# Altium project PCB_Project.PrjPcb
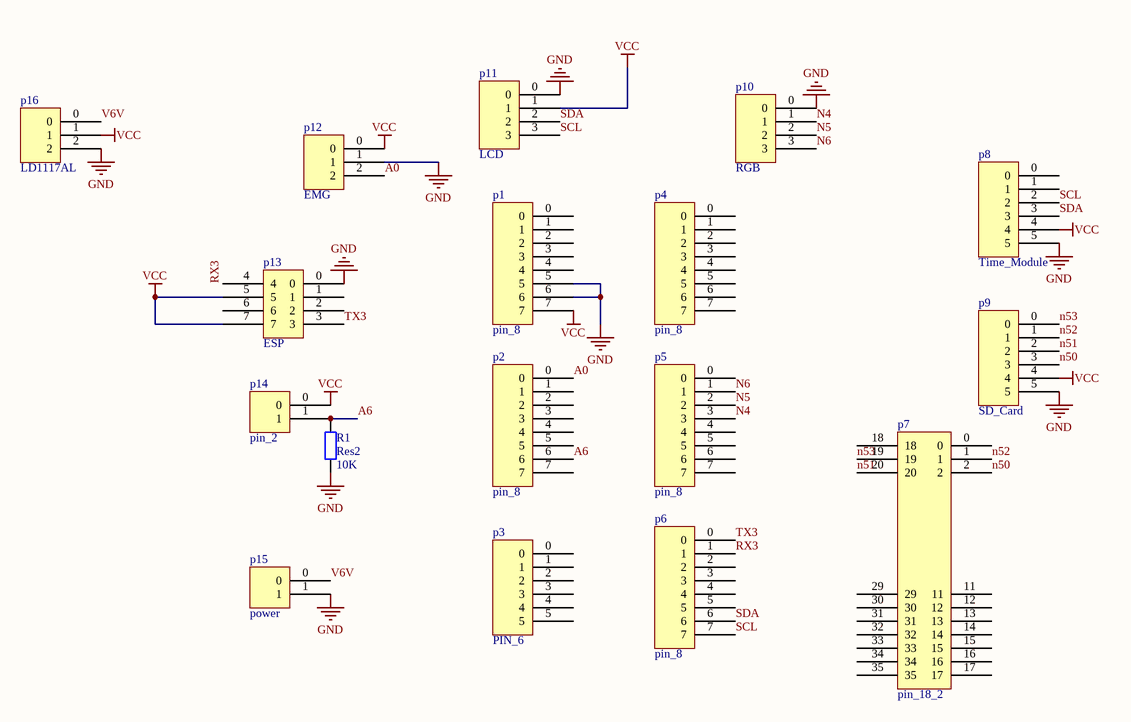
[diagram p0: Sheet1.SchDoc]
1 sheet, 17 parts. Net scope: global (net labels, ports and power ports of the same name join across sheets).
Board file: PCB1.PcbDoc

## Sheet Sheet1.SchDoc
size A4

### Parts
p1  pin_8  [pin_8]
p2  pin_8  [pin_8]
p3  PIN_6  [pin_6]
p4  pin_8  [pin_8]
p5  pin_8  [pin_8]
p6  pin_8  [pin_8]
p7  pin_18_2  [pin_18_2]
p8  Time_Module  [pin_6]
p9  SD_Card  [pin_6]
p10  RGB  [pin_4]
p11  LCD  [pin_4]
p12  EMG  [PIN_3]
p13  ESP  [pin_4_2]
p14  pin_2  [PIN_2]
p15  power  [PIN_2]
p16  LD1117AL  [PIN_3]
R1  Res2  value 10K  [AXIAL-0.4]

### Nets
GND: p1.5 p1.6 p8.5 p9.5 p10.0 p11.0 p12.1 p13.0 p15.1 p16.2 R1.1
VCC: p1.7 p8.4 p9.4 p11.1 p12.0 p13.5 p13.7 p14.0 p16.1
A0: p2.0 p12.2
A6: p2.6 p14.1 R1.2
N4: p5.3 p10.1
N5: p5.2 p10.2
N6: p5.1 p10.3
n50: p7.2 p9.3
n51: p7.20 p9.2
n52: p7.1 p9.1
n53: p7.19 p9.0
RX3: p6.1 p13.4
SCL: p6.7 p8.2 p11.3
SDA: p6.6 p8.3 p11.2
TX3: p6.0 p13.3
V6V: p15.0 p16.0

Not connected (* = marked no-connect by the designer): p1 0 1 2 3 4; p2 1 2 3 4 5 7; p3 0 1 2 3 4 5; p4 0 1 2 3 4 5 6 7; p5 0 4 5 6 7; p6 2 3 4 5; p7 0 11 12 13 14 15 16 17 18 29 30 31 32 33 34 35; p8 0 1; p13 1 2 6

### Library data of the parts
p8 p9 = pin_6
p10 p11 = pin_4
p12 p16 = pin_3
p13 = pin_4_2
p15 = pin_2
R1 = Res2: Resistor; Published: 8-Jun-2000; LatestRevisionDate: 17-Jul-2002; LatestRevisionNote: Re-released for DXP Platform.; PackageReference: AXIAL-0.4; Publisher: Altium Limited; PackageDescription: Axial Device, Thru-Hole; 2 Leads; 0.4 in Pin Spacing